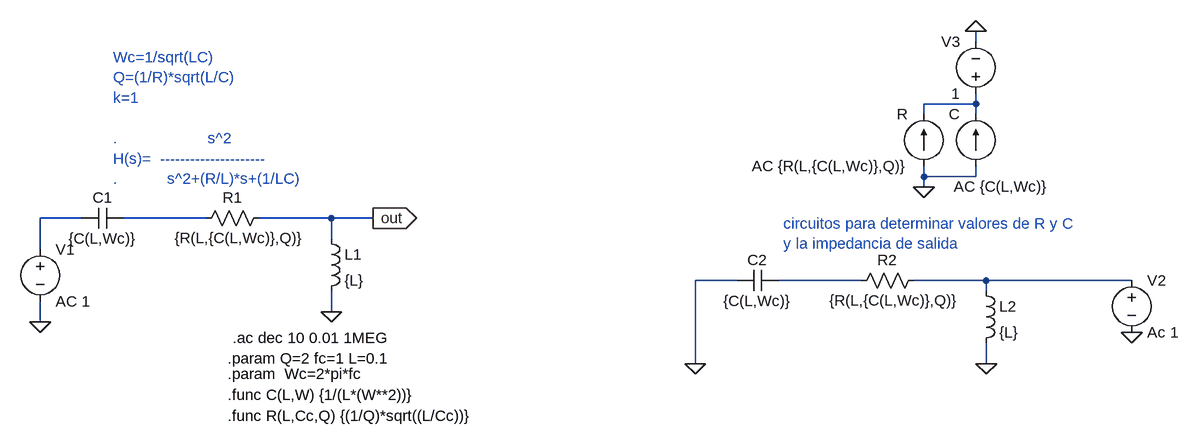
[diagram p0: schematic pasalto.asc]
pasalto.asc, the LTspice schematic file:
Version 4
SHEET 1 2124 680
WIRE 1376 -64 1376 -80
WIRE 1376 32 1376 16
WIRE 1376 32 1296 32
WIRE 1296 48 1296 32
WIRE 1376 48 1376 32
WIRE 1296 144 1296 128
WIRE 1376 144 1376 128
WIRE 1376 144 1296 144
WIRE 1296 160 1296 144
WIRE 0 208 -64 208
WIRE 192 208 64 208
WIRE 384 208 272 208
WIRE 448 208 384 208
WIRE 384 240 384 208
WIRE -64 256 -64 208
WIRE 1008 304 944 304
WIRE 1200 304 1072 304
WIRE 1392 304 1280 304
WIRE 1616 304 1392 304
WIRE 1392 320 1392 304
WIRE 384 352 384 320
WIRE -64 368 -64 336
WIRE 944 432 944 304
WIRE 1392 432 1392 400
FLAG 384 352 0
FLAG -64 368 0
FLAG 448 208 out
IOPIN 448 208 Out
FLAG 1392 432 0
FLAG 944 432 0
FLAG 1616 384 0
FLAG 1296 160 0
FLAG 1376 -80 0
SYMBOL res 288 192 R90
WINDOW 0 0 56 VBottom 2
WINDOW 3 31 45 VTop 2
SYMATTR InstName R1
SYMATTR Value {R(L,{C(L,Wc)},Q)}
SYMBOL ind 368 224 R0
SYMATTR InstName L1
SYMATTR Value {L}
SYMBOL cap 64 224 M270
WINDOW 0 32 32 VTop 2
WINDOW 3 0 32 VBottom 2
SYMATTR InstName C1
SYMATTR Value {C(L,Wc)}
SYMBOL res 1296 288 R90
WINDOW 0 0 56 VBottom 2
WINDOW 3 31 45 VTop 2
SYMATTR InstName R2
SYMATTR Value {R(L,{C(L,Wc)},Q)}
SYMBOL ind 1376 304 R0
SYMATTR InstName L2
SYMATTR Value {L}
SYMBOL cap 1072 320 M270
WINDOW 0 32 32 VTop 2
WINDOW 3 0 32 VBottom 2
SYMATTR InstName C2
SYMATTR Value {C(L,Wc)}
SYMBOL voltage 1616 288 R0
WINDOW 123 0 0 Left 0
WINDOW 39 0 0 Left 0
SYMATTR InstName V2
SYMATTR Value Ac 1
SYMBOL voltage -64 240 R0
WINDOW 123 0 0 Left 0
WINDOW 39 0 0 Left 0
SYMATTR InstName V1
SYMATTR Value AC 1
SYMBOL current 1296 128 R180
WINDOW 0 24 80 Left 2
WINDOW 3 24 0 Left 2
SYMATTR InstName R
SYMATTR Value AC {R(L,{C(L,Wc)},Q)}
SYMBOL current 1376 128 R180
WINDOW 0 24 80 Left 2
WINDOW 3 -111 -31 Left 2
WINDOW 123 0 0 Left 0
WINDOW 39 0 0 Left 0
SYMATTR InstName C
SYMATTR Value AC {C(L,Wc)}
SYMBOL voltage 1376 32 R180
WINDOW 0 24 96 Left 2
WINDOW 3 24 16 Left 2
SYMATTR InstName V3
SYMATTR Value 1
TEXT 224 424 Left 2 !.param Q=2 fc=1 L=0.1
TEXT 224 448 Left 2 !.param  Wc=2*pi*fc
TEXT 224 480 Left 2 !.func C(L,W) {1/(L*(W**2))}
TEXT 48 -40 Left 2 ;Wc=1/sqrt(LC)\nQ=(1/R)*sqrt(L/C)\nk=1\n \n.                    s^2\nH(s)=  ---------------------\n.           s^2+(R/L)*s+(1/LC)
TEXT 224 512 Left 2 !.func R(L,Cc,Q) {(1/Q)*sqrt((L/Cc))}
TEXT 232 392 Left 2 !.ac dec 10 0.01 1MEG
TEXT 1080 216 Left 2 ;circuitos para determinar valores de R y C\ny la impedancia de salida

The netlist it stands for:
* pasalto.asc
R1 out N003 {R(L,{C(L,Wc)},Q)}
L1 out 0 {L}
C1 N003 N002 {C(L,Wc)}
R2 N005 N004 {R(L,{C(L,Wc)},Q)}
L2 N005 0 {L}
C2 N004 0 {C(L,Wc)}
V2 N005 0 Ac 1
V1 N002 0 AC 1
I§R 0 N001 AC {R(L,{C(L,Wc)},Q)}
I§C 0 N001 AC {C(L,Wc)}
V3 N001 0 1
.param Q=2 fc=1 L=0.1
.param  Wc=2*pi*fc
.func C(L,W) {1/(L*(W**2))}
* Wc=1/sqrt(LC)
* Q=(1/R)*sqrt(L/C)
* k=1
* .                    s^2
* H(s)=  ---------------------
* .           s^2+(R/L)*s+(1/LC)
.func R(L,Cc,Q) {(1/Q)*sqrt((L/Cc))}
.ac dec 10 0.01 1MEG
* circuitos para determinar valores de R y C
* y la impedancia de salida
.backanno
.end